# Altium schematic sheet ADS1282.SchDoc
size A4
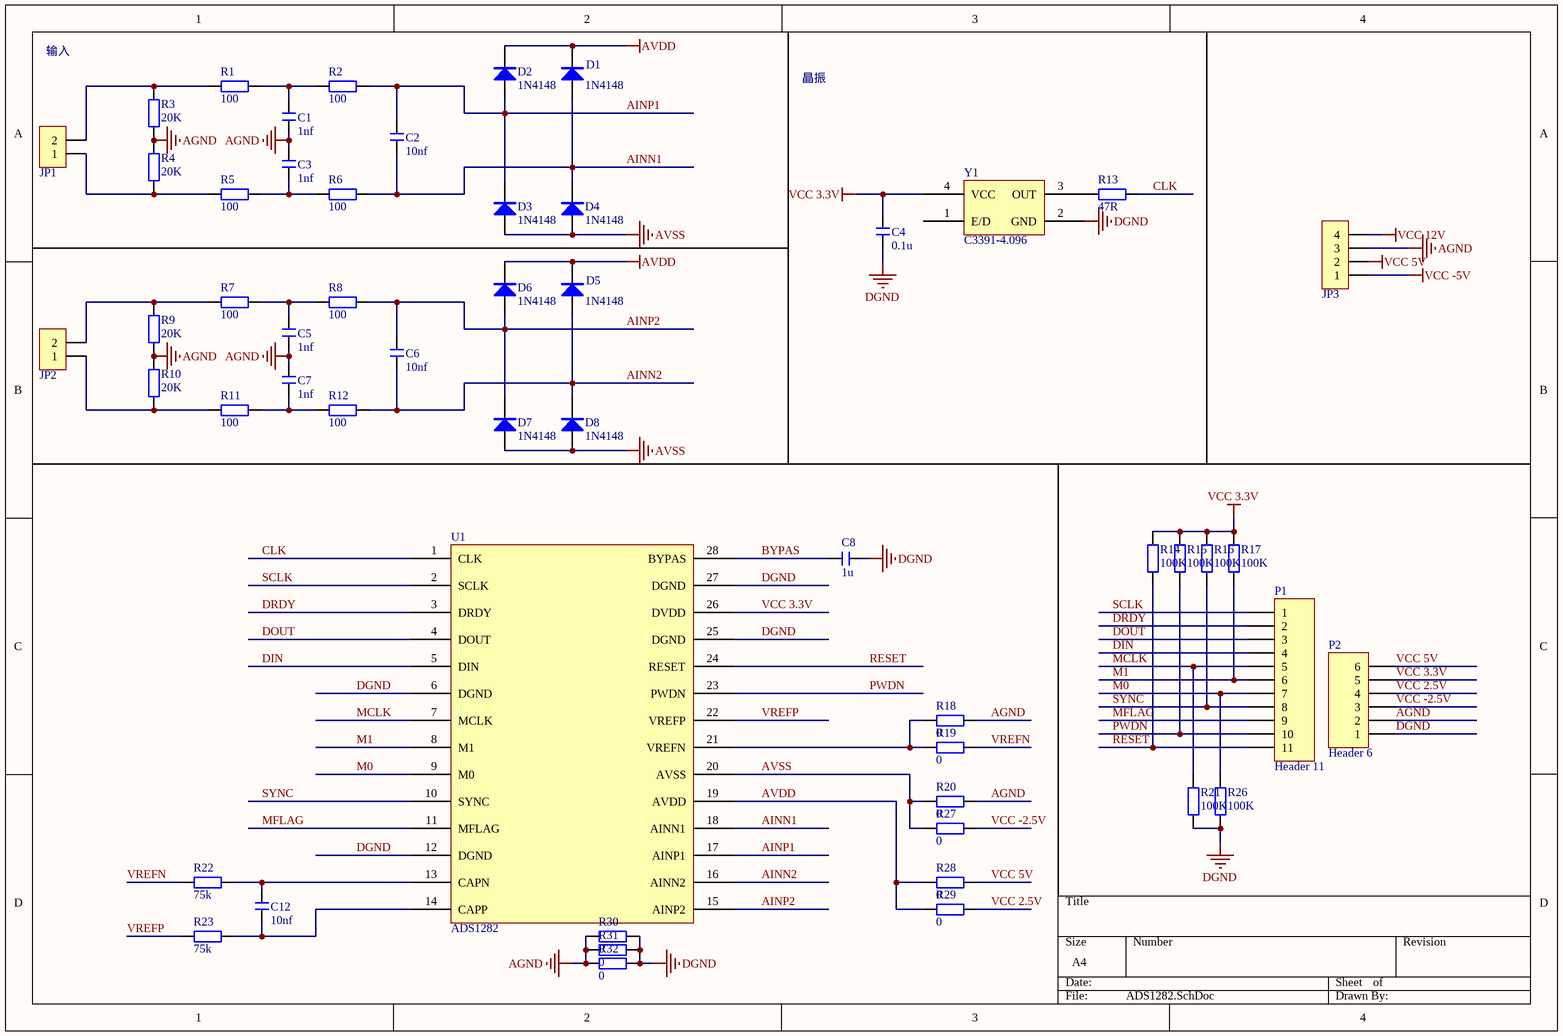
[diagram p0: ADS1282.SchDoc]

## Parts
C1  1nf  [C 0805_L]
C2  10nf  [C 0805_L]
C3  1nf  [C 0805_L]
C4  0.1u  [C 0805_L]
C5  1nf  [C 0805_L]
C6  10nf  [C 0805_L]
C7  1nf  [C 0805_L]
C8  1u  [C 0805_L]
C12  10nf  [C 0805_L]
D1  1N4148  [SOD-523]
D2  1N4148  [SOD-523]
D3  1N4148  [SOD-523]
D4  1N4148  [SOD-523]
D5  1N4148  [SOD-523]
D6  1N4148  [SOD-523]
D7  1N4148  [SOD-523]
D8  1N4148  [SOD-523]
JP1  HDR-1X2  [KF2EDGK5.08-LI-2P]  (value not drawn)
JP2  HDR-1X2  [KF2EDGK5.08-LI-2P]  (value not drawn)
JP3  HDR-1X4  [KF2EDGK5.08-LI-4P]  (value not drawn)
P1  Header 11  [HDR1X11]
P2  Header 6  [HDR1X6]
R1  100  [R 0805_L]
R2  100  [R 0805_L]
R3  20K  [R 0805_L]
R4  20K  [R 0805_L]
R5  100  [R 0805_L]
R6  100  [R 0805_L]
R7  100  [R 0805_L]
R8  100  [R 0805_L]
R9  20K  [R 0805_L]
R10  20K  [R 0805_L]
R11  100  [R 0805_L]
R12  100  [R 0805_L]
R13  47R  [R 0805_L]
R14  100K  [R 0805_L]
R15  100K  [R 0805_L]
R16  100K  [R 0805_L]
R17  100K  [R 0805_L]
R18  0  [R 0603_L]
R19  0  [R 0603_L]
R20  0  [R 0603_L]
R21  100K  [R 0805_L]
R22  75k  [R 0805_L]
R23  75k  [R 0805_L]
R26  100K  [R 0805_L]
R27  0  [R 0603_L]
R28  0  [R 0603_L]
R29  0  [R 0603_L]
R30  0  [R 0805_L]
R31  0  [R 0805_L]
R32  0  [R 0805_L]
U1  ADS1282  [SSOP28_N]
Y1  C3391-4.096  [OSC 3225-4P]

## Nets
AGND: C1.1 C3.2 C5.1 C7.2 JP3.3 P2.2 R3.1 R4.2 R9.1 R10.2 R18.2 R20.2 R30.1 R31.1 R32.1
AVDD: D1.2(K) D2.2(K) D5.2(K) D6.2(K) R28.1 R29.1 U1.19(AVDD)
AVSS: D3.1(A) D4.1(A) D7.1(A) D8.1(A) R20.1 R27.1 U1.20(AVSS)
DGND: C4.1 C8.2 P2.1 R21.1 R26.1 R30.2 R31.2 R32.2 U1.6(DGND) U1.12(DGND) U1.25(DGND) U1.27(DGND) Y1.2(GND)
VCC 3.3V: C4.2 P2.5 R14.2 R15.2 R16.2 R17.2 U1.26(DVDD) Y1.4(VCC)
VCC 5V: JP3.2 P2.6 R28.2
VCC 12V: JP3.4
VCC -5V: JP3.1
AINN1: C2.1 D1.1(A) D4.2(K) R6.2 U1.18(AINN1)
AINN2: C6.1 D5.1(A) D8.2(K) R12.2 U1.16(AINN2)
AINP1: C2.2 D2.1(A) D3.2(K) R2.2 U1.17(AINP1)
AINP2: C6.2 D6.1(A) D7.2(K) R8.2 U1.15(AINP2)
BYPAS: C8.1 U1.28(BYPAS)
CLK: R13.2 U1.1(CLK)
DIN: P1.4 U1.5(DIN)
DOUT: P1.3 U1.4(DOUT)
DRDY: P1.2 U1.3(DRDY)
M0: P1.7 R26.2 U1.9(M0)
M1: P1.6 R17.1 U1.8(M1)
MCLK: P1.5 R21.2 U1.7(MCLK)
MFLAG: P1.9 U1.11(MFLAG)
PWDN: P1.10 R15.1 U1.23(PWDN)
RESET: P1.11 R14.1 U1.24(RESET)
SCLK: P1.1 U1.2(SCLK)
SYNC: P1.8 R16.1 U1.10(SYNC)
VCC 2.5V: P2.4 R29.2
VCC -2.5V: P2.3 R27.2
VREFN: R19.2 R22.1
VREFP: R23.1 U1.22(VREFP)
NetC1_2: C1.2 R1.2 R2.1
NetC3_1: C3.1 R5.2 R6.1
NetC5_2: C5.2 R7.2 R8.1
NetC7_1: C7.1 R11.2 R12.1
NetC12_1: C12.1 R23.2 U1.14(CAPP)
NetC12_2: C12.2 R22.2 U1.13(CAPN)
NetJP1_1: JP1.1 R4.1 R5.1
NetJP1_2: JP1.2 R1.1 R3.2
NetJP2_1: JP2.1 R10.1 R11.1
NetJP2_2: JP2.2 R7.1 R9.2
NetR13_1: R13.1 Y1.3(OUT)
NetR18_1: R18.1 R19.1 U1.21(VREFN)

Not connected (* = marked no-connect by the designer): Y1 1(E/D)

## Notes on the sheet
- 输入
- 晶振

## Library data of the parts
C1-C8 C12 = C: 无极性贴片电容; 版权归属: 源创客; BOM名称: 无极性贴片电容; 学习资源: www.ooocke.com
D1-D8 = 1N4148: 高速开关二极管; 版权归属: 源创客; BOM名称: 高速开关二极管; 学习资源: www.ooocke.com
JP1 JP2 = Header 2: 2P接插件; 版权归属: 源创客; BOM名称: 2P接插件; 学习资源: www.ooocke.com
JP3 = Header 4: 4P接插件; 版权归属: 源创客; BOM名称: 4P接插件; 学习资源: www.ooocke.com
P1 = Header 11: Header, 11-Pin; LatestRevisionDate: 17-Jul-2002; LatestRevisionNote: Re-released for DXP Platform.; Publisher: Altium Limited
P2 = Header 6: Header, 6-Pin; LatestRevisionDate: 17-Jul-2002; LatestRevisionNote: Re-released for DXP Platform.; Publisher: Altium Limited
R1-R23 R26-R32 = R: 贴片电阻; 版权归属: 源创客; BOM名称: 贴片电阻; 学习资源: www.ooocke.com
Y1 = 4.096M